# Altium project R2C2_Mini.PrjPCB
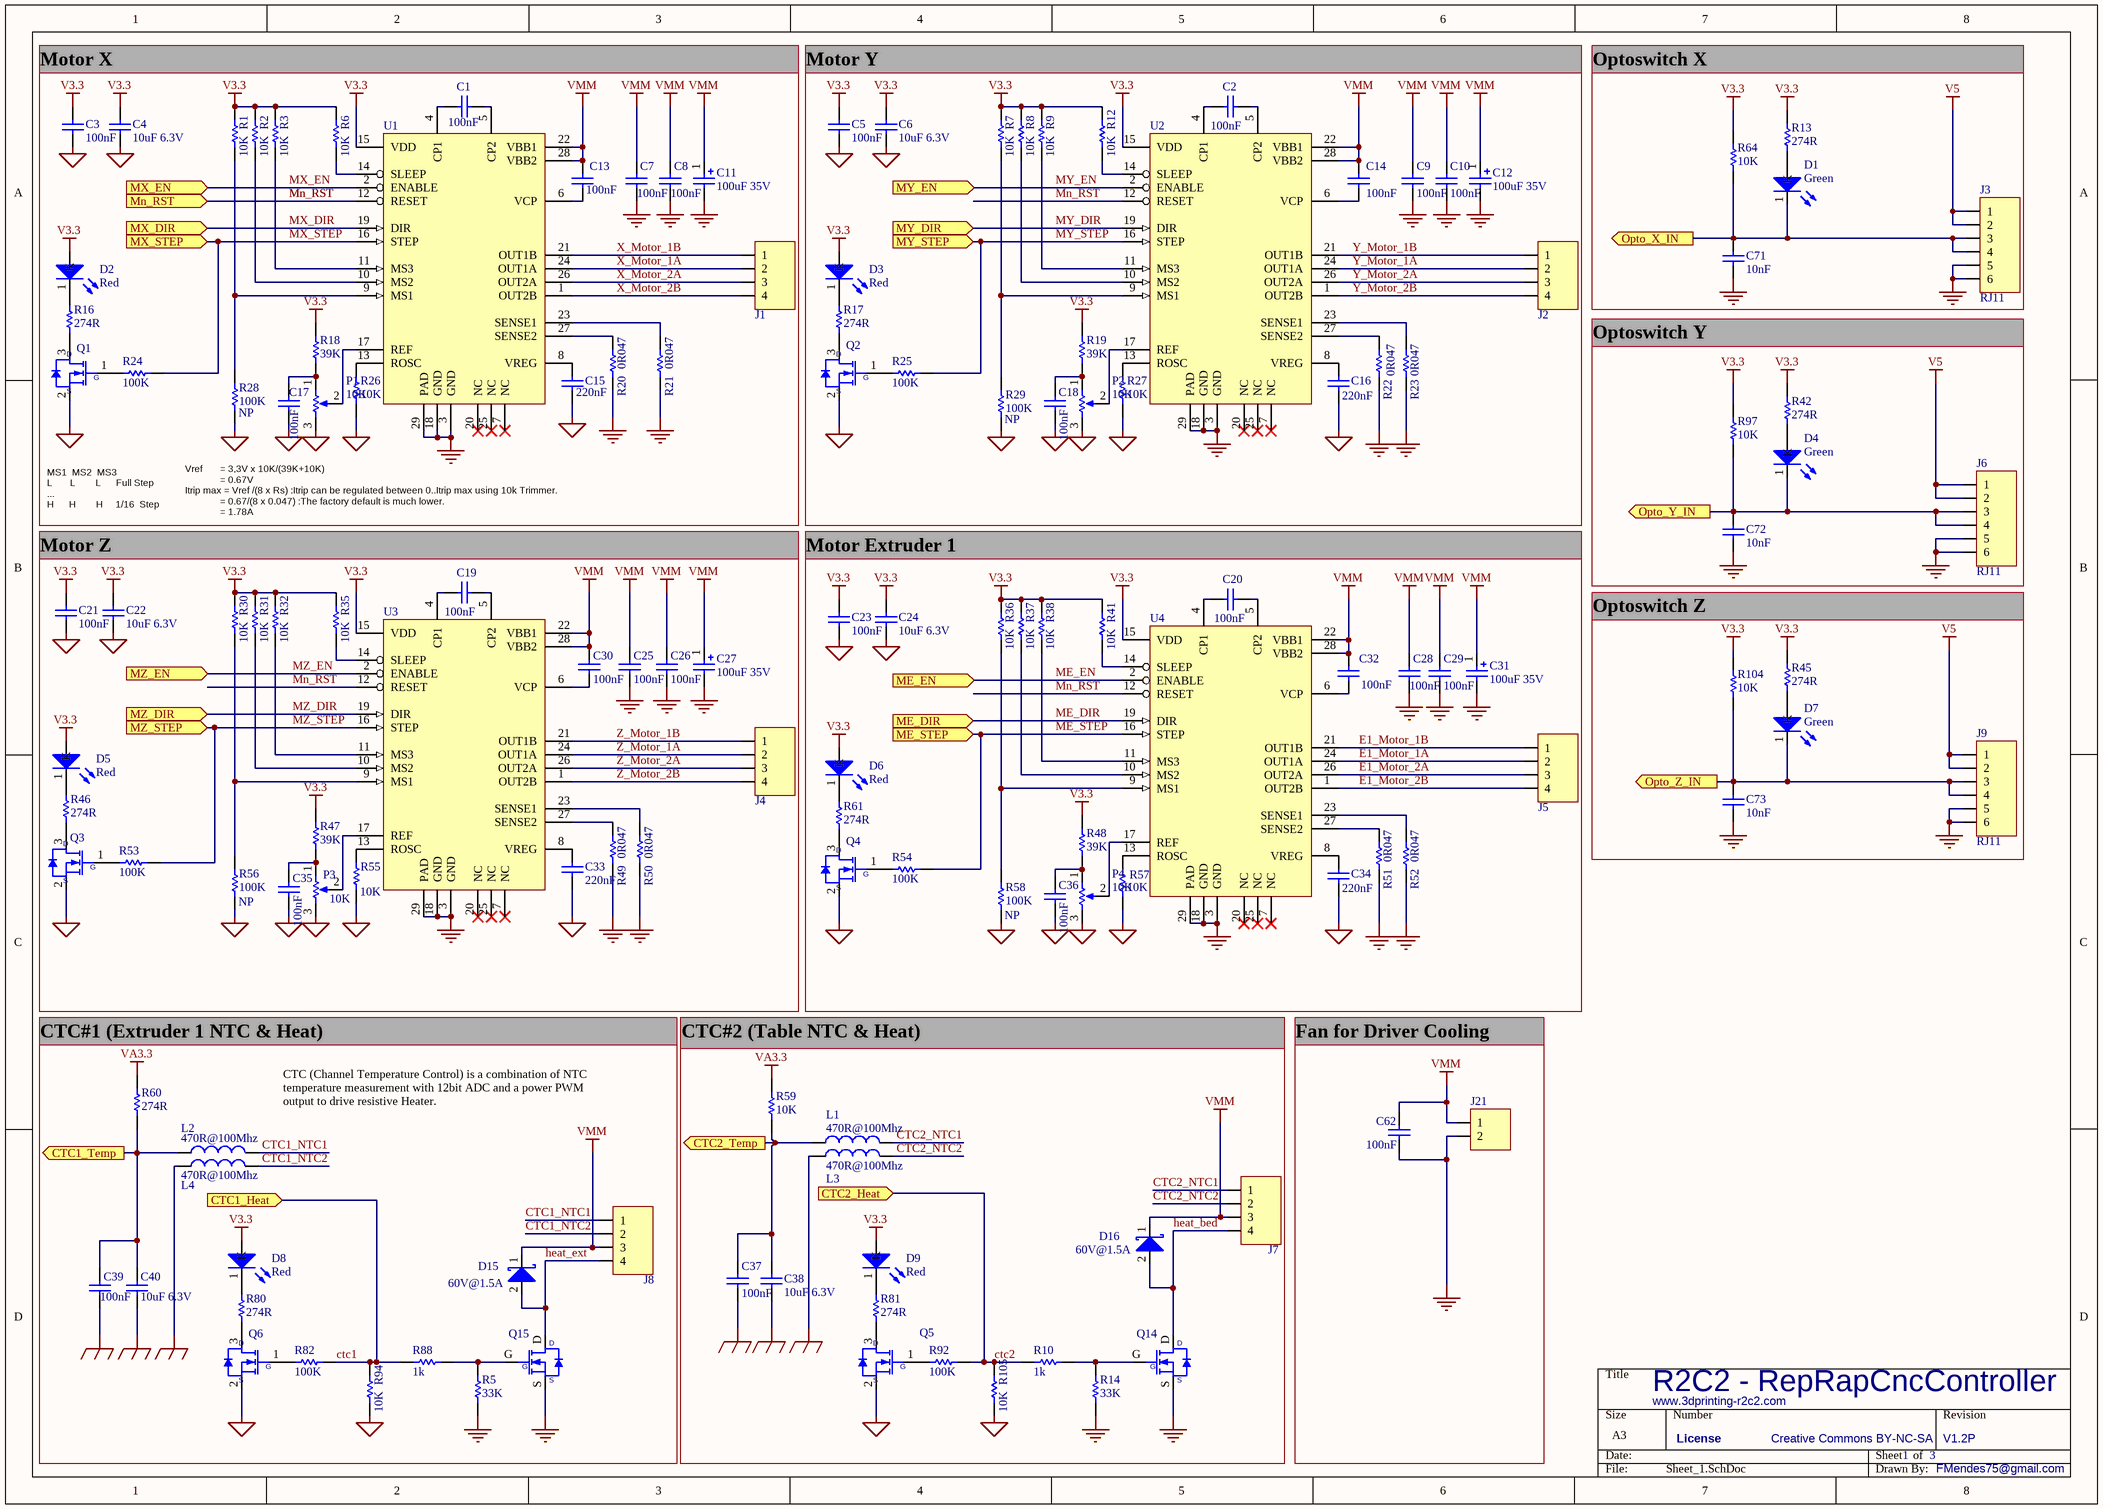
[diagram p0: Sheet_1.SchDoc]
2 sheets, 230 parts. Net scope: flat (ports and power ports of the same name join across sheets).
Board file: R2C2_Mini.PcbDoc
Sheets:
  Sheet_1.SchDoc
  Sheet_2.SchDoc

## Sheet Sheet_1.SchDoc: R2C2 - RepRapCncController
size A3; CompanyName: bitBOX; DrawnBy: FMendes75@gmail.com; Revision: V1.2P; SheetNumber: 1; SheetTotal: 3; PageSetup: Record=PageOptions|CenterHorizontal=True|CenterVertical=True|PrintScale=1.04|XCorrection=1.00|YCorrection=1.00|PrintKind=1|BorderSize=5000000|LeftOffset=0|BottomOffset=0|Orientation=2|PaperLength=1000|PaperWidth=1000|Scale=100|PaperSource=7|PrintQuality=-4|MediaType=1|DitherType=10|PaperKind=A3|PrintScaleMode=1; license: Creative Commons BY-NC-SA; Site: www.3dprinting-r2c2.com; ProjectName: R2C2 - RepRapCncController

### Parts
C1  100nF  [CAPC1608M]
C2  100nF  [CAPC1608M]
C3  100nF  [CAPC1608M]
C4  10uF 6.3V  [CAPC2012M]
C5  100nF  [CAPC1608M]
C6  10uF 6.3V  [CAPC2012M]
C7  100nF  [CAPC1608M]
C8  100nF  [CAPC1608M]
C9  100nF  [CAPC1608M]
C10  100nF  [CAPC1608M]
C11  100uF 35V  [CAPAE63x63MM]
C12  100uF 35V  [CAPAE63x63MM]
C13  100nF  [CAPC1608M]
C14  100nF  [CAPC1608M]
C15  220nF  [CAPC1608M]
C16  220nF  [CAPC1608M]
C17  100nF  [CAPC1608M]
C18  100nF  [CAPC1608M]
C19  100nF  [CAPC1608M]
C20  100nF  [CAPC1608M]
C21  100nF  [CAPC1608M]
C22  10uF 6.3V  [CAPC2012M]
C23  100nF  [CAPC1608M]
C24  10uF 6.3V  [CAPC2012M]
C25  100nF  [CAPC1608M]
C26  100nF  [CAPC1608M]
C27  100uF 35V  [CAPAE63x63MM]
C28  100nF  [CAPC1608M]
C29  100nF  [CAPC1608M]
C30  100nF  [CAPC1608M]
C31  100uF 35V  [CAPAE63x63MM]
C32  100nF  [CAPC1608M]
C33  220nF  [CAPC1608M]
C34  220nF  [CAPC1608M]
C35  100nF  [CAPC1608M]
C36  100nF  [CAPC1608M]
C37  100nF  [CAPC1608M]
C38  10uF 6.3V  [CAPC2012M]
C39  100nF  [CAPC1608M]
C40  10uF 6.3V  [CAPC2012M]
C62  100nF  [CAPC1608M]
C71  10nF  [CAPC1608M]
C72  10nF  [CAPC1608M]
C73  10nF  [CAPC1608M]
D1  Green  [LEDM_3216X12M]
D2  Red  [LEDM_3216X12M]
D3  Red  [LEDM_3216X12M]
D4  Green  [LEDM_3216X12M]
D5  Red  [LEDM_3216X12M]
D6  Red  [LEDM_3216X12M]
D7  Green  [LEDM_3216X12M]
D8  Red  [LEDM_3216X12M]
D9  Red  [LEDM_3216X12M]
D15  60V@1.5A  [SMA]
D16  60V@1.5A  [SMA]
J1  (no value)  [TE_SCREW_1X4]
J2  (no value)  [TE_SCREW_1X4]
J3  RJ11  [MOLEX_95022-2667]
J4  (no value)  [TE_SCREW_1X4]
J5  (no value)  [TE_SCREW_1X4]
J6  RJ11  [MOLEX_95022-2667]
J7  (no value)  [TE_SCREW_282841-4]
J8  (no value)  [TE_SCREW_282841-4]
J9  RJ11  [MOLEX_95022-2667]
J21  -  [MOLEX_22-29-2021]  (value not drawn)
L1  470R@100Mhz  [INDC1608M]
L2  470R@100Mhz  [INDC1608M]
L3  470R@100Mhz  [INDC1608M]
L4  470R@100Mhz  [INDC1608M]
P1  10K  [Trimmer_14]
P2  10K  [Trimmer_14]
P3  10K  [Trimmer_14]
P4  10K  [Trimmer_14]
Q1  (no value)  [SOT323-3AM]
Q2  (no value)  [SOT323-3AM]
Q3  (no value)  [SOT323-3AM]
Q4  (no value)  [SOT323-3AM]
Q5  (no value)  [SOT323-3AM]
Q6  (no value)  [SOT323-3AM]
Q14  (no value)  [SuperSOP8_csd17301]
Q15  (no value)  [SuperSOP8_csd17301]
R1  10K  [RESC1608M]
R2  10K  [RESC1608M]
R3  10K  [RESC1608M]
R5  33K  [RESC1608M]
R6  10K  [RESC1608M]
R7  10K  [RESC1608M]
R8  10K  [RESC1608M]
R9  10K  [RESC1608M]
R10  1k  [RESC1608M]
R12  10K  [RESC1608M]
R13  274R  [RESC1608M]
R14  33K  [RESC1608M]
R16  274R  [RESC1608M]
R17  274R  [RESC1608M]
R18  39K  [RESC1608M]
R19  39K  [RESC1608M]
R20  0R047  [RESC3216M]
R21  0R047  [RESC3216M]
R22  0R047  [RESC3216M]
R23  0R047  [RESC3216M]
R24  100K  [RESC1608M]
R25  100K  [RESC1608M]
R26  10K  [RESC1608M]
R27  10K  [RESC1608M]
R28  100K  Populate: NP  [RESC1608M]
R29  100K  Populate: NP  [RESC1608M]
R30  10K  [RESC1608M]
R31  10K  [RESC1608M]
R32  10K  [RESC1608M]
R35  10K  [RESC1608M]
R36  10K  [RESC1608M]
R37  10K  [RESC1608M]
R38  10K  [RESC1608M]
R41  10K  [RESC1608M]
R42  274R  [RESC1608M]
R45  274R  [RESC1608M]
R46  274R  [RESC1608M]
R47  39K  [RESC1608M]
R48  39K  [RESC1608M]
R49  0R047  [RESC3216M]
R50  0R047  [RESC3216M]
R51  0R047  [RESC3216M]
R52  0R047  [RESC3216M]
R53  100K  [RESC1608M]
R54  100K  [RESC1608M]
R55  10K  [RESC1608M]
R56  100K  Populate: NP  [RESC1608M]
R57  10K  [RESC1608M]
R58  100K  Populate: NP  [RESC1608M]
R59  10K  [RESC1608M]
R60  274R  [RESC1608M]
R61  274R  [RESC1608M]
R64  10K  [RESC1608M]
R80  274R  [RESC1608M]
R81  274R  [RESC1608M]
R82  100K  [RESC1608M]
R88  1k  [RESC1608M]
R92  100K  [RESC1608M]
R94  10K  [RESC1608M]
R97  10K  [RESC1608M]
R104  10K  [RESC1608M]
R105  10K  [RESC1608M]
U1  (no value)  [QFN50P500X500X100-28M]
U2  (no value)  [QFN50P500X500X100-28M]
U3  (no value)  [QFN50P500X500X100-28M]
U4  (no value)  [QFN50P500X500X100-28M]

### Ports
CTC1_Heat (in), CTC1_Temp (out), CTC2_Heat (in), CTC2_Temp (out), ME_DIR (in), ME_EN (in), ME_STEP (in), Mn_RST (in), MX_DIR (in), MX_EN (in), MX_STEP (in), MY_DIR (in), MY_EN (in), MY_STEP (in), MZ_DIR (in), MZ_EN (in), MZ_STEP (in), Opto_X_IN (out), Opto_Y_IN (out), Opto_Z_IN (out)

### Nets
GND: C3.1 C4.1 C5.1 C6.1 C15.1 C16.1 C17.1 C18.2 C21.1 C22.1 C23.1 C24.1 C33.1 C34.1 C35.1 C36.1 P1.3(TOP) P2.3(TOP) P3.3(TOP) P4.3(TOP) Q1.2(S) Q2.2(S) Q3.2(S) Q4.2(S) Q5.2(S) Q6.2(S) R26.1 R27.1 R28.1 R29.1 R55.1 R56.1 R57.1 R58.1 R94.1 R105.1
GND_A: C37.1 C38.1 C39.1 C40.1 L3.1 L4.1
Star_GND: C7.2 C8.1 C9.1 C10.1 C11.2 C12.2 C25.1 C26.1 C27.2 C28.1 C29.1 C31.2 C62.1 C71.2 C72.2 C73.2 J3.5 J3.6 J6.5 J6.6 J9.5 J9.6 J21.2 Q14.S Q15.S R5.1 R14.1 R20.1 R21.1 R22.1 R23.1 R49.1 R50.1 R51.1 R52.1 U1.3(GND) U1.18(GND) U1.29(PAD) U2.3(GND) U2.18(GND) U2.29(PAD) U3.3(GND) U3.18(GND) U3.29(PAD) U4.3(GND) U4.18(GND) U4.29(PAD)
V3.3: C3.2 C4.2 C5.2 C6.2 C21.2 C22.2 C23.2 C24.2 D2.2(A) D3.2(A) D5.2(A) D6.2(A) D8.2(A) D9.2(A) R1.2 R2.2 R3.2 R6.2 R7.2 R8.2 R9.2 R12.2 R13.2 R18.2 R19.2 R30.2 R31.2 R32.2 R35.2 R36.2 R37.2 R38.2 R41.2 R42.2 R45.2 R47.2 R48.2 R64.2 R97.2 R104.2 U1.15(VDD) U2.15(VDD) U3.15(VDD) U4.15(VDD)
V5: J3.1 J3.2 J6.1 J6.2 J9.1 J9.2
VA3.3: R59.2 R60.2
VMM: C7.1 C8.2 C9.2 C10.2 C11.1 C12.1 C13.2 C14.2 C25.2 C26.2 C27.1 C28.2 C29.2 C30.2 C31.1 C32.2 C62.2 D15.1(K) D16.1(K) J7.3 J8.3 J21.1 U1.22(VBB1) U1.28(VBB2) U2.22(VBB1) U2.28(VBB2) U3.22(VBB1) U3.28(VBB2) U4.22(VBB1) U4.28(VBB2)
ctc1: R82.2 R88.1 R94.2 ; port CTC1_Heat
CTC1_NTC1: J8.1 L2.2
CTC1_NTC2: J8.2 L4.2
ctc2: R10.1 R92.2 R105.2 ; port CTC2_Heat
CTC2_NTC1: J7.1 L1.2
CTC2_NTC2: J7.2 L3.2
E1_Motor_1A: J5.2 U4.24(OUT1A)
E1_Motor_1B: J5.1 U4.21(OUT1B)
E1_Motor_2A: J5.3 U4.26(OUT2A)
E1_Motor_2B: J5.4 U4.1(OUT2B)
heat_bed: D16.2(A) J7.4 Q14.D
heat_ext: D15.2(A) J8.4 Q15.D
ME_DIR: U4.19(DIR) ; port ME_DIR
ME_EN: U4.2(ENABLE) ; port ME_EN
ME_STEP: R54.2 U4.16(STEP) ; port ME_STEP
Mn_RST: U1.12(RESET) U2.12(RESET) U3.12(RESET) U4.12(RESET) ; port Mn_RST
MX_DIR: U1.19(DIR) ; port MX_DIR
MX_EN: U1.2(ENABLE) ; port MX_EN
MX_STEP: R24.2 U1.16(STEP) ; port MX_STEP
MY_DIR: U2.19(DIR) ; port MY_DIR
MY_EN: U2.2(ENABLE) ; port MY_EN
MY_STEP: R25.2 U2.16(STEP) ; port MY_STEP
MZ_DIR: U3.19(DIR) ; port MZ_DIR
MZ_EN: U3.2(ENABLE) ; port MZ_EN
MZ_STEP: R53.2 U3.16(STEP) ; port MZ_STEP
X_Motor_1A: J1.2 U1.24(OUT1A)
X_Motor_1B: J1.1 U1.21(OUT1B)
X_Motor_2A: J1.3 U1.26(OUT2A)
X_Motor_2B: J1.4 U1.1(OUT2B)
Y_Motor_1A: J2.2 U2.24(OUT1A)
Y_Motor_1B: J2.1 U2.21(OUT1B)
Y_Motor_2A: J2.3 U2.26(OUT2A)
Y_Motor_2B: J2.4 U2.1(OUT2B)
Z_Motor_1A: J4.2 U3.24(OUT1A)
Z_Motor_1B: J4.1 U3.21(OUT1B)
Z_Motor_2A: J4.3 U3.26(OUT2A)
Z_Motor_2B: J4.4 U3.1(OUT2B)
NetC1_1: C1.1 U1.5(CP2)
NetC1_2: C1.2 U1.4(CP1)
NetC2_1: C2.1 U2.4(CP1)
NetC2_2: C2.2 U2.5(CP2)
NetC13_1: C13.1 U1.6(VCP)
NetC14_1: C14.1 U2.6(VCP)
NetC15_2: C15.2 U1.8(VREG)
NetC16_2: C16.2 U2.8(VREG)
NetC17_2: C17.2 P1.1(BOT) R18.1
NetC18_1: C18.1 P2.1(BOT) R19.1
NetC19_1: C19.1 U3.5(CP2)
NetC19_2: C19.2 U3.4(CP1)
NetC20_1: C20.1 U4.4(CP1)
NetC20_2: C20.2 U4.5(CP2)
NetC30_1: C30.1 U3.6(VCP)
NetC32_1: C32.1 U4.6(VCP)
NetC33_2: C33.2 U3.8(VREG)
NetC34_2: C34.2 U4.8(VREG)
NetC35_2: C35.2 P3.1(BOT) R47.1
NetC36_2: C36.2 P4.1(BOT) R48.1
NetC37_2: C37.2 C38.2 L1.1 R59.1 ; port CTC2_Temp
NetC39_2: C39.2 C40.2 L2.1 R60.1 ; port CTC1_Temp
NetC71_1: C71.1 D1.1(K) J3.3 J3.4 R64.1 ; port Opto_X_IN
NetC72_1: C72.1 D4.1(K) J6.3 J6.4 R97.1 ; port Opto_Y_IN
NetC73_1: C73.1 D7.1(K) J9.3 J9.4 R104.1 ; port Opto_Z_IN
NetD1_2: D1.2(A) R13.1
NetD2_1: D2.1(K) R16.2
NetD3_1: D3.1(K) R17.2
NetD4_2: D4.2(A) R42.1
NetD5_1: D5.1(K) R46.2
NetD6_1: D6.1(K) R61.2
NetD7_2: D7.2(A) R45.1
NetD8_1: D8.1(K) R80.2
NetD9_1: D9.1(K) R81.2
NetP1_2: P1.2(TAP) U1.17(REF)
NetP2_2: P2.2(TAP) U2.17(REF)
NetP3_2: P3.2(TAP) U3.17(REF)
NetP4_2: P4.2(TAP) U4.17(REF)
NetQ1_1: Q1.1(G) R24.1
NetQ1_3: Q1.3(D) R16.1
NetQ2_1: Q2.1(G) R25.1
NetQ2_3: Q2.3(D) R17.1
NetQ3_1: Q3.1(G) R53.1
NetQ3_3: Q3.3(D) R46.1
NetQ4_1: Q4.1(G) R54.1
NetQ4_3: Q4.3(D) R61.1
NetQ5_1: Q5.1(G) R92.1
NetQ5_3: Q5.3(D) R81.1
NetQ6_1: Q6.1(G) R82.1
NetQ6_3: Q6.3(D) R80.1
NetQ14_G: Q14.G R10.2 R14.2
NetQ15_G: Q15.G R5.2 R88.2
NetR1_1: R1.1 R28.2 U1.9(MS1)
NetR2_1: R2.1 U1.10(MS2)
NetR3_1: R3.1 U1.11(MS3)
NetR6_1: R6.1 U1.14(SLEEP)
NetR7_1: R7.1 R29.2 U2.9(MS1)
NetR8_1: R8.1 U2.10(MS2)
NetR9_1: R9.1 U2.11(MS3)
NetR12_1: R12.1 U2.14(SLEEP)
NetR20_2: R20.2 U1.27(SENSE2)
NetR21_2: R21.2 U1.23(SENSE1)
NetR22_2: R22.2 U2.27(SENSE2)
NetR23_2: R23.2 U2.23(SENSE1)
NetR26_2: R26.2 U1.13(ROSC)
NetR27_2: R27.2 U2.13(ROSC)
NetR30_1: R30.1 R56.2 U3.9(MS1)
NetR31_1: R31.1 U3.10(MS2)
NetR32_1: R32.1 U3.11(MS3)
NetR35_1: R35.1 U3.14(SLEEP)
NetR36_1: R36.1 R58.2 U4.9(MS1)
NetR37_1: R37.1 U4.10(MS2)
NetR38_1: R38.1 U4.11(MS3)
NetR41_1: R41.1 U4.14(SLEEP)
NetR49_2: R49.2 U3.27(SENSE2)
NetR50_2: R50.2 U3.23(SENSE1)
NetR51_2: R51.2 U4.27(SENSE2)
NetR52_2: R52.2 U4.23(SENSE1)
NetR55_2: R55.2 U3.13(ROSC)
NetR57_2: R57.2 U4.13(ROSC)

Not connected (* = marked no-connect by the designer): U1 7(NC)* 20(NC)* 25(NC)*; U2 7(NC)* 20(NC)* 25(NC)*; U3 7(NC)* 20(NC)* 25(NC)*; U4 7(NC)* 20(NC)* 25(NC)*

### Notes on the sheet
- Motor X
- Motor Y
- Optoswitch X
- Optoswitch Y
- MS1  MS2  MS3
  L       L        L      Full Step
  ...
  H      H        H     1/16  Step
- Vref       = 3,3V x 10K/(39K+10K)
  = 0.67V
  Itrip max = Vref /(8 x Rs)	:Itrip can be regulated between 0..Itrip max using 10k Trimmer.
  = 0.67/(8 x 0.047)	:The factory default is much lower.
  = 1.78A
- Motor Z
- Motor Extruder 1
- Optoswitch Z
- (near R60) CTC#1 (Extruder 1 NTC & Heat)
- (near R59) CTC#2 (Table NTC & Heat)
- Fan for Driver Cooling
- CTC (Channel Temperature Control) is a combination of NTC
  temperature measurement with 12bit ADC and a power PWM
  output to drive resistive Heater.
- License

### Library data of the parts
C1-C3 C5 C7-C10 C13 C14 C17-C21 C23 C25 C26 C28-C30 C32 C35-C37 C39 C62 = 10000054: CAP CER 0.1UF 50V Y5V 0603; Manufacturer: Yageo; Man PN: CC0603ZRY5V9BB104; Pack: 0603; Value: 100nF; Component Type: Standard; Digi-Key: 311-1343-1-ND
C4 C6 C22 C24 C38 C40 = 10000001: CAP CER 10UF 10V Y5V 0805; Manufacturer: Yageo; Man PN: CC0805ZKY5V6BB106; Pack: 0805; Value: 10uF 6.3V; Component Type: Standard; Digi-Key: 311-1355-1-ND
C11 C12 C27 C31 = 10000069: CAP ALUM 100UF 35V 20% SMD; Manufacturer: Panasonic; Man PN: EEE-HA1V101XP; Component Type: Standard; Value: 100uF 35V; Digi-Key: PCE4238CT-ND
C15 C16 C33 C34 = 10000059: CAP CER 0.22UF 16V 10% X7R 0603; Manufacturer: TDK; Pack: 0603; Man PN: C1608X7R1C224K080AC; Value: 220nF; Component Type: Standard; Digi-Key: 445-1318-1-ND
C71-C73 = 10000057: CAP CER 10000PF 50V 10% X7R 0603; Manufacturer: TDK; Pack: 0603; Man PN: C1608X7R1H103K080AA; Component Type: Standard; Value: 10nF; Digi-Key: 445-1311-1-ND
D1 D4 D7 = 10000008: LED CHIPLED 570NM GREEN 1206 SMD; Manufacturer: OSRAM; Man PN: LG N971-KN-1; Pack: 1206; Value: Green; Component Type: Standard; Digi-Key: 475-1407-1-ND
D2 D3 D5 D6 D8 D9 = 10000089: LED CHIPLED 645NM RED DIFF 1206; Manufacturer: OSRAM; Man PN: LH N974-KN-1; Pack: 1206; Value: Red; Digi-Key: 475-1416-1-ND; Signal Integrity: -; Simulation: -; Component Type: Standard
D15 D16 = 10000010: DIODE SCHOTTKY 60V 2.1A DO214AC; Manufacturer: VISHAY; Man PN: VS-10MQ060NTRPBF; Component Type: Standard; Value: 60V@1.5A; Pack: SMA; Digi-Key: 10MQ060NPBFCT-ND
J1 J2 J7 J8 = 10000023: Con 4; Manufacturer: TE; Man PN: 282841-4; Component Type: Standard
  J1 J2: Digi-Key: A98335-ND
  J7 J8: Digi-Key: A98081-ND
J3 J6 J9 = 10000062: CONN MOD JACK R/A 6P4C; Manufacturer: Stewart Connector; Man PN: SS-6446-NF; Value: RJ11; Digi-Key: 380-1018-ND; Component Type: Standard
J4 J5 = 10000023: Con 4; Manufacturer: TE; Man PN: 282834-4; Digi-Key: A98335-ND; Component Type: Standard
J21 = 10000097: CONN HEADER 2POS .100 VERT GOLD; Manufacturer: Molex; Component Type: Standard; Man PN: 22-29-2021; Value: -; Pack: -; Digi-Key: WM2744-ND
L1-L4 = 10000032: FERRITE CHIP 470 OHM 1000MA 0603; Manufacturer: MURATA; Man PN: BLM18PG471SN1D; Pack: 0603; Value: 470R@100Mhz; Component Type: Standard; Digi-Key: 490-5223-1-ND
P1-P4 = 10000092: TRIMMER 10K OHM 0.5W TH; Manufacturer: copal; Man PN: CT6EP103; Component Type: Standard; Value: 10K; Pack: -; Digi-Key: CT6EP103-ND
Q1-Q6 = 10000039: MOSFET N-CH SGL 60V SOT-323; Manufacturer: NXP; Man PN: 2N7002PW; Pack: SOT323; Component Type: Standard; Digi-Key: 568-5987-1-ND
Q14 Q15 = 10000039: MOSFET N-CH 30V 28A 8SON; Manufacturer: Texas Instruments; Man PN: CSD17301Q5A; Pack: SOT323; Component Type: Standard; Digi-Key: 296-25795-1-ND
R1-R3 R6-R9 R12 R26 R27 R30-R32 R35-R38 R41 R55 R57 R59 R64 R94 R97 R104 R105 = 10000044: RES 10K OHM 1/10W 5% 0603 SMD; Manufacturer: Yageo; Man PN: RC0603JR-0710KL; Pack: 0603; Value: 10K; Component Type: Standard; Digi-Key: 311-10KGRCT-ND
R5 R14 = 10000044: RES 33K OHM 1/10W 1% 0603; Manufacturer: Stackpole Electronics Inc; Man PN: RMCF0603FT33K0; Pack: 0603; Value: 33K; Component Type: Standard; Digi-Key: RMCF0603FT33K0CT-ND
R10 R88 = 10000042: RES 1K OHM 1/10W 5% 0603; Manufacturer: Stackpole Electronics Inc; Man PN: RMCF0603JT1K00; Pack: 0603; Value: 1k; Component Type: Standard; Digi-Key: RMCF0603JT1K00CT-ND
R13 R16 R17 R42 R45 R46 R60 R61 R80 R81 = 10000041: RES 274 OHM 1/10W 1% 0603; Manufacturer: Stackpole Electronics Inc; Man PN: RMCF0603FT274R; Pack: 0603; Value: 274R; Component Type: Standard; Digi-Key: RMCF0603FT274RCT-ND
R18 R19 R47 R48 = 10000087: RES 39K OHM 1/10W 1% 0603; Manufacturer: Stackpole Electronics Inc; Man PN: RMCF0603FT39K0; Pack: 0603; Value: 39K; Component Type: Standard; Digi-Key: RMCF0603FT39K0CT-ND
R20-R23 R49-R52 = 10000047: RES .047 OHM 1/2W 1% 1206 SMD; Manufacturer: Ohmite; Man PN: LVK12R047FER; Pack: 1206; Value: 0R047; Component Type: Standard; Digi-Key: LVK12R047FERCT-ND
R24 R25 R28 R29 R53 R54 R56 R58 R82 R92 = 10000045: RES 100K OHM 1/10W 5% 0603 SMD; Manufacturer: Yageo; Man PN: RC0603JR-07100KL; Pack: 0603; Value: 100K; Component Type: Standard; Digi-Key: 311-100KGRCT-ND
U1 = 10000094: IC MOTOR DRIVER PAR 28QFN; Manufacturer: Allegro MicroSystems, LLC; Man PN: A4988SETTR-T; Pack: QFN28; Value: A4988SETTR-T; Component Type: Standard; Digi-Key: 620-1343-1-ND
U2-U4 = 10000094: IC MOTOR DRIVER PAR 28QFN; Manufacturer: Allegro MicroSystems, LLC; Man PN: A4988SETTR-T; Value: A4988SETTR-T; Pack: QFN28; Component Type: Standard; Digi-Key: 620-1343-1-ND

## Sheet Sheet_2.SchDoc: R2C2 - Mini Printer Controller
size A3; DrawnBy: FMendes75@gmail.com; Revision: V0.3; SheetNumber: 2; SheetTotal: 3; =Revision: V1.1; license: Creative Commons BY-NC-SA; site: www.3dprinting-r2c2.com
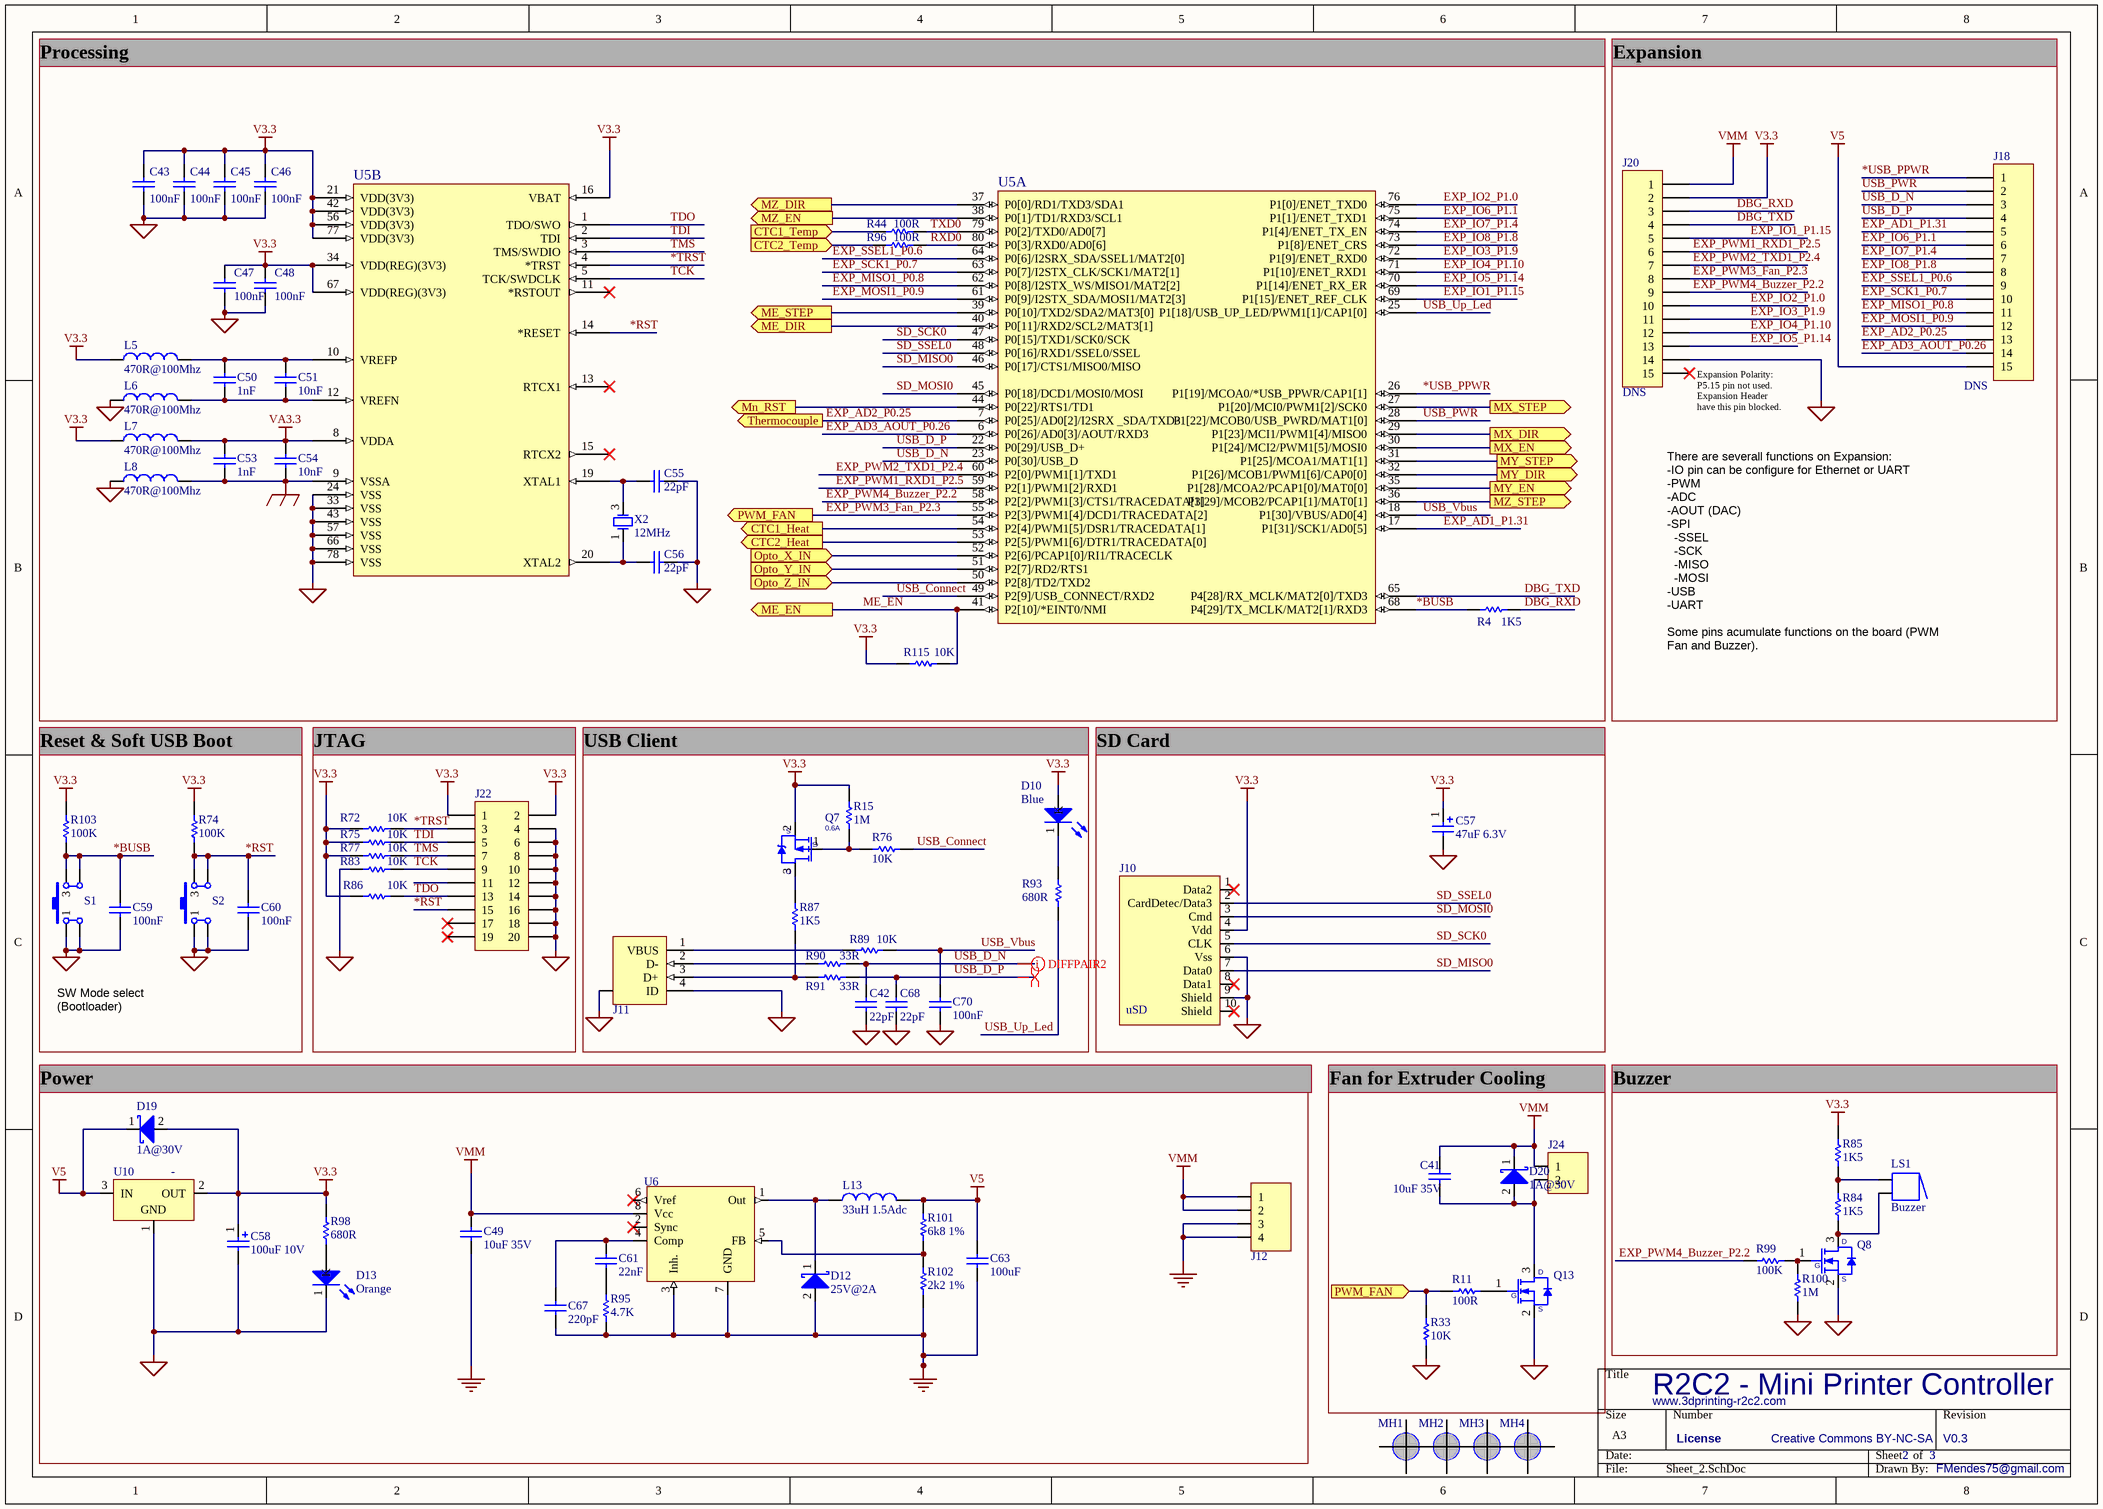
[diagram p1: Sheet_2.SchDoc]

### Parts
C41  10uF 35V  [CAPC3216M]
C42  22pF  [CAPC1608M]
C43  100nF  [CAPC1608M]
C44  100nF  [CAPC1608M]
C45  100nF  [CAPC1608M]
C46  100nF  [CAPC1608M]
C47  100nF  [CAPC1608M]
C48  100nF  [CAPC1608M]
C49  10uF 35V  [CAPC3216M]
C50  1nF  [CAPC1608M]
C51  10nF  [CAPC1608M]
C53  1nF  [CAPC1608M]
C54  10nF  [CAPC1608M]
C55  22pF  [CAPC1608M]
C56  22pF  [CAPC1608M]
C57  47uF 6.3V  [Tant_nichicon_B]
C58  100uF 10V  [CAPAE6666X54M]
C59  100nF  [CAPC1608M]
C60  100nF  [CAPC1608M]
C61  22nF  [CAPC1608M]
C63  100uF  [CAPC3216M]
C67  220pF  [CAPC1608M]
C68  22pF  [CAPC1608M]
C70  100nF  [CAPC1608M]
D10  Blue  [LEDM_3216X12M]
D12  25V@2A  [SMB]
D13  Orange  [LEDM_3216X12M]
D19  1A@30V  [SOD323]
D20  1A@30V  [SOD323]
J10  uSD  [3M_2900]
J11  micro-usb  [USB_47589-001]  (value not drawn)
J12  (no value)  [TE_SCREW_282841-4]
J18  Populate: DNS  [HDR1X15]
J20  Populate: DNS  [HDR1X15]
J22  (no value)  [HDR2X10]
J24  -  [MOLEX_22-29-2021]  (value not drawn)
L5  470R@100Mhz  [INDC1608M]
L6  470R@100Mhz  [INDC1608M]
L7  470R@100Mhz  [INDC1608M]
L8  470R@100Mhz  [INDC1608M]
L13  33uH 1.5Adc  [INDP6x6]
LS1  Buzzer  [TDK_PS1240]
MH1  -  [MH_M3]  (value not drawn)  (no BOM)
MH2  -  [MH_M3]  (value not drawn)  (no BOM)
MH3  -  [MH_M3]  (value not drawn)  (no BOM)
MH4  -  [MH_M3]  (value not drawn)  (no BOM)
Q7  0.6A  [SOT23-3M]
Q8  (no value)  [SOT323-3AM]
Q13  (no value)  [SOT323-3AM]
R4  1K5  [RESC1608M]
R11  100R  [RESC1608M]
R15  1M  [RESC1608M]
R33  10K  [RESC1608M]
R44  100R  [RESC1608M]
R72  10K  [RESC1608M]
R74  100K  [RESC1608M]
R75  10K  [RESC1608M]
R76  10K  [RESC1608M]
R77  10K  [RESC1608M]
R83  10K  [RESC1608M]
R84  1K5  [RESC1608M]
R85  1K5  [RESC1608M]
R86  10K  [RESC1608M]
R87  1K5  [RESC1608M]
R89  10K  [RESC1608M]
R90  33R  [RESC1608M]
R91  33R  [RESC1608M]
R93  680R  [RESC1608M]
R95  4.7K  [CAPC1608M]
R96  100R  [RESC1608M]
R98  680R  [RESC1608M]
R99  100K  [RESC1608M]
R100  1M  [RESC1608M]
R101  6k8 1%  [RESC1608M]
R102  2k2 1%  [RESC1608M]
R103  100K  [RESC1608M]
R115  10K  [RESC1608M]
S1  SW-PB  [SW_FSM6JSMA]  (value not drawn)
S2  SW-PB  [SW_FSM6JSMA]  (value not drawn)
U5  (no value)  [TSQFP50P1400X1400X160-80M]  (parts A,B of 2)
U6  (no value)  [SOIC127P600-8M]
U10  -  [SOT223-4M]
X2  12MHz  [txc_7b_12MHZ]

### Ports
CTC1_Heat (out), CTC1_Temp (in), CTC2_Heat (out), CTC2_Temp (in), ME_DIR (out), ME_EN (out), ME_STEP (out), Mn_RST (out), MX_DIR (out), MX_EN (out), MX_STEP (out), MY_DIR (out), MY_EN (out), MY_STEP (out), MZ_DIR (out), MZ_EN (out), MZ_STEP (out), Opto_X_IN (in), Opto_Y_IN (in), Opto_Z_IN (in), PWM_FAN (in), PWM_FAN (out), Thermocouple (out)

### Nets
GND: C42.1 C43.1 C44.1 C45.2 C46.2 C47.2 C48.2 C55.2 C56.2 C57.2 C58.2 C59.1 C60.1 C68.1 C70.1 D13.1(K) J10.6(Vss) J10.9(Shield) J11.4(ID) J11.5(SHLD) J20.14 J22.4 J22.6 J22.8 J22.10 J22.12 J22.14 J22.16 J22.18 J22.20 L6.1 L8.1 Q8.2(S) Q13.2(S) R33.1 R83.1 R100.1 S1.1 S1.2 S2.1 S2.2 U5.24(VSS) U5.33(VSS) U5.43(VSS) U5.57(VSS) U5.66(VSS) U5.78(VSS) U10.1(GND)
GND_A: C53.1 C54.1 L8.2 U5.9(VSSA)
Star_GND: C49.1 C63.1 C67.1 D12.2(A) J12.3 J12.4 R95.1 R102.1 U6.3(Inh.) U6.7(GND)
V3.3: C43.2 C44.2 C45.1 C46.1 C47.1 C48.1 C57.1 C58.1 D10.2(A) D19.2(A) J10.4(Vdd) J20.2 J22.1 J22.2 L5.1 L7.1 Q7.2(S) R15.2 R72.1 R74.2 R75.1 R77.1 R85.2 R86.1 R98.2 R103.2 R115.1 U5.16(VBAT) U5.21(VDD(3V3)) U5.34(VDD(REG)(3V3)) U5.42(VDD(3V3)) U5.56(VDD(3V3)) U5.67(VDD(REG)(3V3)) U5.77(VDD(3V3)) U10.2(OUT)
V5: C63.2 D19.1(K) J18.15 L13.2 R101.2 U10.3(IN)
VA3.3: C53.2 C54.2 L7.2 U5.8(VDDA)
VMM: C41.2 C49.2 D20.1(K) J12.1 J12.2 J20.1 J24.1 U6.8(Vcc)
*BUSB: C59.2 R4.1 R103.1 S1.3 S1.4 U5.68(P4[29]/TX_MCLK/MAT2[1]/RXD3)
*RST: C60.2 J22.15 R74.1 S2.3 S2.4 U5.14(*RESET)
*TRST: J22.3 R72.2 U5.4(*TRST)
*USB_PPWR: J18.1 U5.26(P1[19]/MCOA0/*USB_PPWR/CAP1[1])
ctc1: U5.54(P2[4]/PWM1[5]/DSR1/TRACEDATA[1]) ; port CTC1_Heat
ctc2: U5.53(P2[5]/PWM1[6]/DTR1/TRACEDATA[0]) ; port CTC2_Heat
DBG_RXD: J20.3 R4.2
DBG_TXD: J20.4 U5.65(P4[28]/RX_MCLK/MAT2[0]/TXD3)
EXP_AD1_P1.31: J18.5 U5.17(P1[31]/SCK1/AD0[5])
EXP_AD2_P0.25: J18.13 U5.7(P0[25]/AD0[2]/I2SRX__SDA/TXD3) ; port Thermocouple
EXP_AD3_AOUT_P0.26: J18.14 U5.6(P0[26]/AD0[3]/AOUT/RXD3)
EXP_IO1_P1.15: J20.5 U5.69(P1[15]/ENET_REF_CLK)
EXP_IO2_P1.0: J20.10 U5.76(P1[0]/ENET_TXD0)
EXP_IO3_P1.9: J20.11 U5.72(P1[9]/ENET_RXD0)
EXP_IO4_P1.10: J20.12 U5.71(P1[10]/ENET_RXD1)
EXP_IO5_P1.14: J20.13 U5.70(P1[14]/ENET_RX_ER)
EXP_IO6_P1.1: J18.6 U5.75(P1[1]/ENET_TXD1)
EXP_IO7_P1.4: J18.7 U5.74(P1[4]/ENET_TX_EN)
EXP_IO8_P1.8: J18.8 U5.73(P1[8]/ENET_CRS)
EXP_MISO1_P0.8: J18.11 U5.62(P0[8]/I2STX_WS/MISO1/MAT2[2])
EXP_MOSI1_P0.9: J18.12 U5.61(P0[9]/I2STX_SDA/MOSI1/MAT2[3])
EXP_PWM1_RXD1_P2.5: J20.6 U5.59(P2[1]/PWM1[2]/RXD1)
EXP_PWM2_TXD1_P2.4: J20.7 U5.60(P2[0]/PWM1[1]/TXD1)
EXP_PWM3_Fan_P2.3: J20.8 R11.1 R33.2 U5.55(P2[3]/PWM1[4]/DCD1/TRACEDATA[2]) ; port PWM_FAN
EXP_PWM4_Buzzer_P2.2: J20.9 R99.1 U5.58(P2[2]/PWM1[3]/CTS1/TRACEDATA[3])
EXP_SCK1_P0.7: J18.10 U5.63(P0[7]/I2STX_CLK/SCK1/MAT2[1])
EXP_SSEL1_P0.6: J18.9 U5.64(P0[6]/I2SRX_SDA/SSEL1/MAT2[0])
ME_DIR: U5.40(P0[11]/RXD2/SCL2/MAT3[1]) ; port ME_DIR
ME_EN: R115.2 U5.41(P2[10]/*EINT0/NMI) ; port ME_EN
ME_STEP: U5.39(P0[10]/TXD2/SDA2/MAT3[0]) ; port ME_STEP
Mn_RST: U5.44(P0[22]/RTS1/TD1) ; port Mn_RST
MX_DIR: U5.29(P1[23]/MCI1/PWM1[4]/MISO0) ; port MX_DIR
MX_EN: U5.30(P1[24]/MCI2/PWM1[5]/MOSI0) ; port MX_EN
MX_STEP: U5.27(P1[20]/MCI0/PWM1[2]/SCK0) ; port MX_STEP
MY_DIR: U5.32(P1[26]/MCOB1/PWM1[6]/CAP0[0]) ; port MY_DIR
MY_EN: U5.35(P1[28]/MCOA2/PCAP1[0]/MAT0[0]) ; port MY_EN
MY_STEP: U5.31(P1[25]/MCOA1/MAT1[1]) ; port MY_STEP
MZ_DIR: U5.37(P0[0]/RD1/TXD3/SDA1) ; port MZ_DIR
MZ_EN: U5.38(P0[1]/TD1/RXD3/SCL1) ; port MZ_EN
MZ_STEP: U5.36(P1[29]/MCOB2/PCAP1[1]/MAT0[1]) ; port MZ_STEP
RXD0: R96.2 U5.80(P0[3]/RXD0/AD0[6])
SD_MISO0: J10.7(Data0) U5.46(P0[17]/CTS1/MISO0/MISO)
SD_MOSI0: J10.3(Cmd) U5.45(P0[18]/DCD1/MOSI0/MOSI)
SD_SCK0: J10.5(CLK) U5.47(P0[15]/TXD1/SCK0/SCK)
SD_SSEL0: J10.2(CardDetec/Data3) U5.48(P0[16]/RXD1/SSEL0/SSEL)
TCK: J22.9 R83.2 U5.5(TCK/SWDCLK)
TDI: J22.5 R75.2 U5.2(TDI)
TDO: J22.13 R86.2 U5.1(TDO/SWO)
TMS: J22.7 R77.2 U5.3(TMS/SWDIO)
TXD0: R44.2 U5.79(P0[2]/TXD0/AD0[7])
USB_Connect: R76.2 U5.49(P2[9]/USB_CONNECT/RXD2)
USB_D_N: C42.2 J18.3 R90.2 U5.23(P0[30]/USB_D)
USB_D_P: C68.2 J18.4 R91.2 U5.22(P0[29]/USB_D+)
USB_PWR: J18.2 U5.28(P1[22]/MCOB0/USB_PWRD/MAT1[0])
USB_Up_Led: R93.1 U5.25(P1[18]/USB_UP_LED/PWM1[1]/CAP1[0])
USB_Vbus: C70.2 R89.2 U5.18(P1[30]/VBUS/AD0[4])
NetC37_2: R96.1 ; port CTC2_Temp
NetC39_2: R44.1 ; port CTC1_Temp
NetC41_1: C41.1 D20.2(A) J24.2 Q13.3(D)
NetC50_1: C50.1 C51.1 L6.2 U5.12(VREFN)
NetC50_2: C50.2 C51.2 L5.2 U5.10(VREFP)
NetC55_1: C55.1 U5.19(XTAL1) X2.3(OSC2)
NetC56_1: C56.1 U5.20(XTAL2) X2.1(OSC1)
NetC61_1: C61.1 R95.2
NetC61_2: C61.2 C67.2 U6.4(Comp)
NetC71_1: U5.52(P2[6]/PCAP1[0]/RI1/TRACECLK) ; port Opto_X_IN
NetC72_1: U5.51(P2[7]/RD2/RTS1) ; port Opto_Y_IN
NetC73_1: U5.50(P2[8]/TD2/TXD2) ; port Opto_Z_IN
NetD10_1: D10.1(K) R93.2
NetD12_1: D12.1(K) L13.1 U6.1(Out)
NetD13_2: D13.2(A) R98.1
NetJ11_1: J11.1(VBUS) R89.1
NetJ11_2: J11.2(D-) R90.1
NetJ11_3: J11.3(D+) R87.1 R91.1
NetLS1_1: LS1.1 R84.2 R85.1
NetLS1_2: LS1.2 Q8.3(D) R84.1
NetQ7_1: Q7.1(G) R15.1 R76.1
NetQ7_3: Q7.3(D) R87.2
NetQ8_1: Q8.1(G) R99.2 R100.2
NetQ13_1: Q13.1(G) R11.2
NetR101_1: R101.1 R102.2 U6.5(FB)

Not connected (* = marked no-connect by the designer): J10 1(Data2)* 8(Data1)* 10(Shield)*; J20 15*; J22 11 17* 19*; U5 11(*RSTOUT)* 13(RTCX1)* 15(RTCX2)*; U6 2(Sync)* 6(Vref)*

### Layout directives
differential pair: USB_D_N, USB_D_P

### Notes on the sheet
- Processing
- Expansion
- (near J20) Expansion Polarity: P5.15 pin not used.
  Expansion Header have this pin blocked.
- There are severall functions on Expansion:
  -IO pin can be configure for Ethernet or UART
  -PWM
  -ADC
  -AOUT (DAC)
  -SPI
  -SSEL
  -SCK
  -MISO
  -MOSI
  -USB
  -UART
  Some pins acumulate functions on the board (PWM Fan and Buzzer).
- Reset & Soft USB Boot
- JTAG
- USB Client
- SD Card
- SW Mode select (Bootloader)
- Power
- Fan for Extruder Cooling
- (near R85) Buzzer
- License

### Library data of the parts
C41 = 10000002: CAP CER 10UF 35V Y5V 1206; Manufacturer: Taiyo Yuden; Man PN: GMK316F106ZL-T; Pack: 1206; Component Type: Standard; Value: 10uF 35V; Digi-Key: 587-1352-1-ND
C42 C55 C56 C68 = 10000056: CAP CER 22PF 50V 5% NP0 0603; Manufacturer: TDK; Pack: 0603; Man PN: C1608C0G1H220J080AA; Component Type: Standard; Value: 22pF; Digi-Key: 445-1273-1-ND
C43-C48 C59 C60 C70 = 10000054: as C1 on sheet Sheet_1; Value: 100nF; Component Type: Standard; Digi-Key: 311-1343-1-ND
C49 = 10000054: CAP CER 10UF 35V Y5V 1206; Manufacturer: Taiyo Yuden; Man PN: GMK316F106ZL-T; Pack: 1206; Component Type: Standard; Value: 10uF 35V; Digi-Key: 587-1352-1-ND
C50 C53 = 10000058: CAP CER 1000PF 50V 10% X7R 0603; Manufacturer: TDK; Pack: 0603; Man PN: CGA3E2X7R1H102K080AA; Value: 1nF; Component Type: Standard; Digi-Key: 445-5659-1-ND
C51 C54 = 10000057: as C71 on sheet Sheet_1; Value: 10nF; Component Type: Standard; Digi-Key: 445-1311-1-ND
C57 = 10000005: CAP TANT 47UF 6.3V 10% 1411; Manufacturer: Nichicon; Man PN: F930J476KBA; Pack: B; Component Type: Standard; Value: 47uF 6.3V; Digi-Key: 493-4122-1-ND
C58 = 10000086: CAP ALUM 100UF 16V 20% SMD; Manufacturer: Nichicon; Man PN: UWX1C101MCL1GB; Component Type: Standard; Value: 100uF 10V; Pack: -; Signal Integrity: -; Simulation: -; Digi-Key: 493-2105-1-ND
C61 = 10000066: CAP CER 0.022UF 50V 20% X7R 0603; Manufacturer: TDK; Pack: 0603; Man PN: C1608X7R1H223M080AA; Value: 22nF; Component Type: Standard; Digi-Key: 445-5092-1-ND
C63 = 10000054: CAP CER 100UF 10V 20% X5R 1206; Manufacturer: TDK; Man PN: C3216X5R1A107M160AC; Pack: 1206; Component Type: Standard; Value: 100uF; Digi-Key: 445-6007-1-ND
C67 = 10000055: CAP CER 220PF 50V 5% NP0 0603; Manufacturer: TDK; Pack: 0603; Man PN: C1608C0G1H221J080AA; Value: 220pF; Component Type: Standard; Digi-Key: 445-1285-1-ND
D10 = 10000065: LED BLUE CLEAR 1206 REV MT SMD; Manufacturer: Lite-On Inc; Man PN: LTST-C230TBKT; Pack: 1206; Value: Blue; Component Type: Standard; Digi-Key: 160-1889-1-ND
D12 = 10000009: DIODE SCHOTTKY 25V 2A SMB; Manufacturer: STMicroelectronics; Man PN: STPS2L25U; Component Type: Standard; Value: 25V@2A; Pack: SMB; Digi-Key: 497-5573-1-ND
D13 = 10000007: LED 3.2X1.6MM 601NM ORN CLR SMD; Manufacturer: OSRAM; Man PN: LYN971-Z; Pack: 1206; Value: Orange; Component Type: Standard; Digi-Key: 754-1140-1-ND
D19 D20 = 10000085: DIODE SCHOTTKY 30V 1A SOD323F; Manufacturer: NXP; Man PN: PMEG3010CEJ,115; Component Type: Standard; Value: 1A@30V; Pack: SOD323F; Signal Integrity: -; Simulation: -; Digi-Key: 568-4124-1-ND
J10 = 10000029: CONN MINI MICRO-SD 8PIN PCB GOLD; Manufacturer: Amphenol; Man PN: 101-00581-59; Value: uSD; Component Type: Standard; Digi-Key: 101-00581-59-1-ND
J11 = Con 4 USB: CONN RCPT MICRO USB AB R/A SMD; Manufacturer: Molex Inc; Man PN: 475890001; Digi-Key: WM17143CT-ND; Value: micro-usb
J12 = 10000023: as J1 on sheet Sheet_1; Digi-Key: A98081-ND; Component Type: Standard
J18 J20 = 10000067: 15 SIL VERT PIN HDR; Manufacturer: Harwin Inc; Man PN: M20-9771546; Component Type: Standard; Digi-Key: 952-1856-ND
J22 = 10000064: Headers & Wire Housings 2 X 10 SHROUDED HDR; Manufacturer: Molex; Man PN: 90130-1120; Value: 2x10x2.54mm; Populate: DNS; Component Type: Standard
J24 = 10000097: as J21 on sheet Sheet_1; Component Type: Standard; Man PN: 22-29-2021; Value: -; Pack: -; Digi-Key: WM2744-ND
L5-L8 = 10000032: as L1 on sheet Sheet_1; Value: 470R@100Mhz; Component Type: Standard; Digi-Key: 490-5223-1-ND
L13 = 10000081: INDUCTOR 33UH 1.4A 20% SMD; Manufacturer: Taiyo Yuden; Man PN: NR6045T330M; Pack: 10x10x5.8; Value: 33uH 1.5Adc; Signal Integrity: -; Simulation: -; Component Type: Standard; Digi-Key: 587-2634-1-ND
LS1 = 10000068: BUZZER PIEZO 4KHZ 12.2MM PC MNT; Manufacturer: TDK; Man PN: PS1240P02BT; Pack: 1010; Component Type: Standard; Digi-Key: 445-2525-1-ND; Value: Buzzer
MH1-MH4 = 1000000: MH; Man PN: -; Manufacturer: -; Value: -; Pack: -; Component Type: Standard (No BOM)
Q7 = 10000076: MOSFET P-CH 30V 760MA SOT-23; Manufacturer: International Rectifier; Man PN: IRLML5103TRPBF; Component Type: Standard; Value: 0.6A; Pack: Sot-23; Signal Integrity: -; Simulation: -; Digi-Key: IRLML5103PBFCT-ND
Q8 Q13 = 10000039: as Q1 on sheet Sheet_1; Component Type: Standard; Digi-Key: 568-5987-1-ND
R4 R84 R85 R87 = 10000048: RES 1.5K OHM 1/10W 5% 0603; Manufacturer: Stackpole Electronics Inc; Man PN: RMCF0603JT1K50; Pack: 0603; Component Type: Standard; Value: 1K5; Digi-Key: RMCF0603JT1K50CT-ND
R11 R44 R96 = 10000042: RES 100 OHM 1/10W 5% 0603; Manufacturer: Stackpole Electronics Inc; Man PN: RMCF0603JT100R; Pack: 0603; Value: 100R; Component Type: Standard; Digi-Key: RMCF0603JT100RCT-ND
R15 R100 = 10000049: RES 1M OHM 1/10W 1% 0603; Manufacturer: Stackpole Electronics Inc; Man PN: RMCF0603FT1M00; Pack: 0603; Value: 1M; Component Type: Standard; Digi-Key: RMCF0603FT1M00CT-ND
R33 R72 R75-R77 R83 R86 R89 R115 = 10000044: as R1 on sheet Sheet_1; Value: 10K; Component Type: Standard; Digi-Key: 311-10KGRCT-ND
R74 R99 R103 = 10000045: as R24 on sheet Sheet_1; Value: 100K; Component Type: Standard; Digi-Key: 311-100KGRCT-ND
R90 R91 = 10000053: RES 33 OHM 1/10W 1% 0603; Manufacturer: Stackpole Electronics Inc; Man PN: RMCF0603FT33R0; Pack: 0603; Value: 33R; Component Type: Standard; Digi-Key: RMCF0603FT33R0CT-ND
R93 R98 = 10000061: RES 680 OHM 1/10W 1% 0603 SMD; Manufacturer: Panasonic; Man PN: ERJ-3EKF6800V; Pack: 0603; Value: 680R; Component Type: Standard; Digi-Key: P680HCT-ND
R95 = 10000050: 4K7; Manufacturer: Multicomp; Man PN: MC 0.063W 0603 1% 4K7; Pack: 0603; Value: 4.7K; Component Type: Standard; Digi-Key: RMCF0603FT47K0CT-ND
R101 = 10000080: RES 6.8K OHM 1/10W 1% 0603; Manufacturer: Stackpole Electronics Inc; Man PN: RMCF0603FT6K80; Pack: 0603; Value: 6k8 1%; Component Type: Standard; Digi-Key: RMCF0603FT6K80CT-ND
R102 = 10000079: RES 2.2K OHM 1/10W .1% 0603 SMD; Manufacturer: Panasonic; Man PN: ERJ-3GEYJ222V; Pack: 0603; Value: 2k2 1%; Signal Integrity: -; Simulation: -; Component Type: Standard; Digi-Key: P2.2KGCT-ND
S1 S2 = 10000019: SWITCH TACTILE SPST-NO 0.05A 12V; Manufacturer: TE Connectivity; Man PN: FSM6JSMA; Component Type: Standard; Digi-Key: 450-1133-ND; Value: SW-PB
U5 = 10000013: IC ARM CORTEX MCU 512K 80-LQFP; Manufacturer: NXP; Man PN: LPC1758FBD80,551; Pack: LQFP80; Component Type: Standard; Digi-Key: 568-4792-ND
U6 = 10000017: IC REG BUCK ADJ 1A 8SOIC; Manufacturer: STMicroelectronics; Man PN: L5970D013TR; Pack: SO-8; Value: 5.0V; Component Type: Standard; Digi-Key: 497-3636-1-ND
U10 = 10000082: IC REG LDO 3.3V 0.8A SOT223; Manufacturer: Texas Instruments; Man PN: TLV1117-33CDCYR; Pack: Sot-232; Value: 3.3V; Signal Integrity: -; Simulation: -; Component Type: Standard; Digi-Key: 296-21112-1-ND
X2 = 10000040: CRYSTAL 12.000MHZ 18PF SMD; Manufacturer: TXC CORPORATION; Man PN: 7B-12.000MAAJ-T; Value: 12MHz; Component Type: Standard; Digi-Key: 887-1099-1-ND

## Nets that join several sheets
GND: Sheet_1 (36 pins), Sheet_2 (48 pins)
GND_A: Sheet_1 (6 pins), Sheet_2 (C53.1 C54.1 L8.2 U5.9)
Star_GND: Sheet_1 (47 pins), Sheet_2 (10 pins)
V3.3: Sheet_1 (44 pins), Sheet_2 (35 pins)
V5: Sheet_1 (6 pins), Sheet_2 (6 pins)
VA3.3: Sheet_1 (R59.2 R60.2), Sheet_2 (C53.2 C54.2 L7.2 U5.8)
VMM: Sheet_1 (30 pins), Sheet_2 (8 pins)
ctc1: Sheet_1 (R82.2 R88.1 R94.2), Sheet_2 (U5.54)
ctc2: Sheet_1 (R10.1 R92.2 R105.2), Sheet_2 (U5.53)
ME_DIR: Sheet_1 (U4.19), Sheet_2 (U5.40)
ME_EN: Sheet_1 (U4.2), Sheet_2 (R115.2 U5.41)
ME_STEP: Sheet_1 (R54.2 U4.16), Sheet_2 (U5.39)
Mn_RST: Sheet_1 (U1.12 U2.12 U3.12 U4.12), Sheet_2 (U5.44)
MX_DIR: Sheet_1 (U1.19), Sheet_2 (U5.29)
MX_EN: Sheet_1 (U1.2), Sheet_2 (U5.30)
MX_STEP: Sheet_1 (R24.2 U1.16), Sheet_2 (U5.27)
MY_DIR: Sheet_1 (U2.19), Sheet_2 (U5.32)
MY_EN: Sheet_1 (U2.2), Sheet_2 (U5.35)
MY_STEP: Sheet_1 (R25.2 U2.16), Sheet_2 (U5.31)
MZ_DIR: Sheet_1 (U3.19), Sheet_2 (U5.37)
MZ_EN: Sheet_1 (U3.2), Sheet_2 (U5.38)
MZ_STEP: Sheet_1 (R53.2 U3.16), Sheet_2 (U5.36)
NetC37_2: Sheet_1 (C37.2 C38.2 L1.1 R59.1), Sheet_2 (R96.1)
NetC39_2: Sheet_1 (C39.2 C40.2 L2.1 R60.1), Sheet_2 (R44.1)
NetC71_1: Sheet_1 (5 pins), Sheet_2 (U5.52)
NetC72_1: Sheet_1 (5 pins), Sheet_2 (U5.51)
NetC73_1: Sheet_1 (5 pins), Sheet_2 (U5.50)